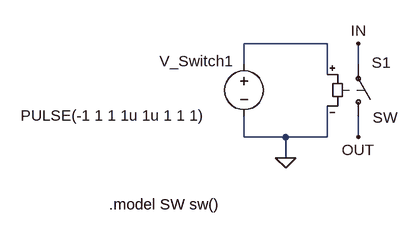
[diagram p0: schematic Timer Switch.asc]
Timer Switch.asc, the LTspice schematic file:
Version 4
SHEET 1 880 680
WIRE 352 96 224 96
WIRE 224 128 224 96
WIRE 400 128 400 96
WIRE 352 144 352 96
WIRE 224 240 224 208
WIRE 288 240 224 240
WIRE 352 240 352 192
WIRE 352 240 288 240
WIRE 400 240 400 208
WIRE 288 272 288 240
FLAG 288 272 0
FLAG 400 96 IN
FLAG 400 240 OUT
SYMBOL sw 400 224 M180
WINDOW 0 21 99 Left 2
WINDOW 3 22 14 Left 2
SYMATTR InstName S1
SYMBOL voltage 224 112 R0
WINDOW 0 -130 11 Left 2
WINDOW 3 -344 95 Left 2
WINDOW 123 0 0 Left 0
WINDOW 39 0 0 Left 0
SYMATTR InstName V_Switch1
SYMATTR Value PULSE(-1 1 1 1u 1u 1 1 1)
TEXT 16 344 Left 2 !.model SW sw()

The netlist it stands for:
* Timer Switch.asc
S1 OUT IN N001 0 SW
V_Switch1 N001 0 PULSE(-1 1 1 1u 1u 1 1 1)
.model SW sw()
.backanno
.end